# Altium project LimePSB-RPCM_1v4.PrjPcb (part 4 of 12)

## Sheet 08_FPGA.SchDoc: FPGA
size A3; Organization: Lime Microsystems; Address1: Surrey Tech Centre; Address2: Guildford GU2 7YG; Address3: Surrey; Address4: United Kingdom; Revision: 1.4; SheetNumber: 8; SheetTotal: 15
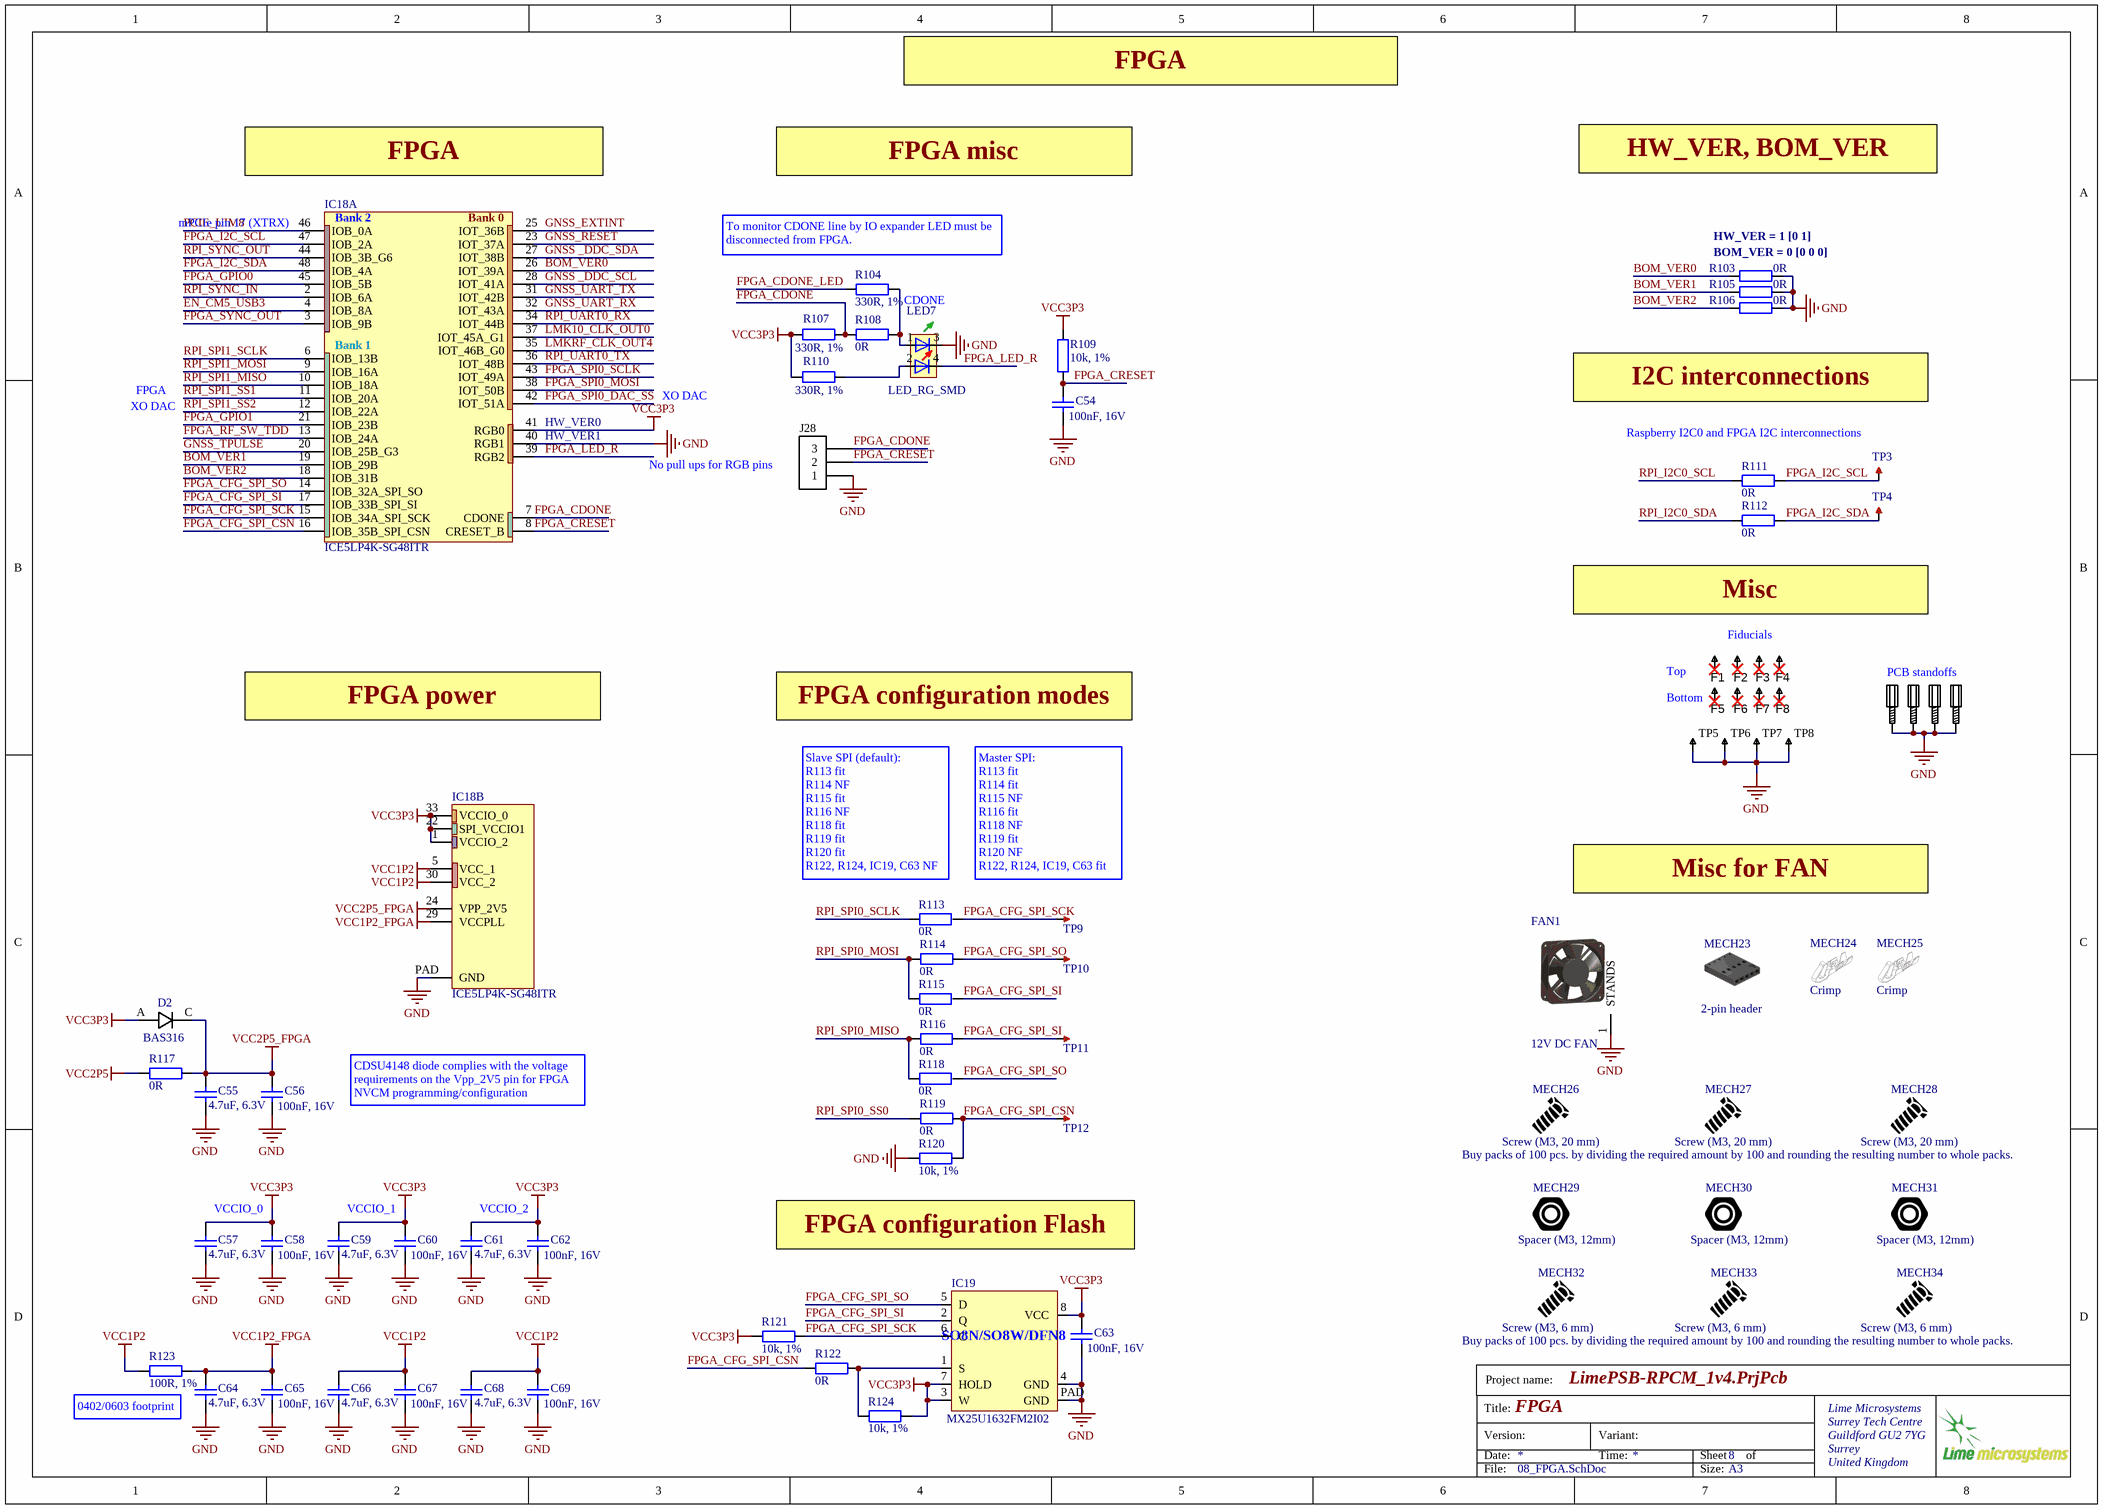
[diagram p7: 08_FPGA.SchDoc]

### Parts
C54  100nF, 16V  [CAP0402]
C55  4.7uF, 6.3V  [CAP0402]
C56  100nF, 16V  [CAP0402]
C57  4.7uF, 6.3V  [CAP0402]
C58  100nF, 16V  [CAP0402]
C59  4.7uF, 6.3V  [CAP0402]
C60  100nF, 16V  [CAP0402]
C61  4.7uF, 6.3V  [CAP0402]
C62  100nF, 16V  [CAP0402]
C63  100nF, 16V  [CAP0402]
C64  4.7uF, 6.3V  [CAP0402]
C65  100nF, 16V  [CAP0402]
C66  4.7uF, 6.3V  [CAP0402]
C67  100nF, 16V  [CAP0402]
C68  4.7uF, 6.3V  [CAP0402]
C69  100nF, 16V  [CAP0402]
D2  BAS316  [BAS316_DIODE_SOD323]
F1  Fiducial  [Fiducial]  (value not drawn)
F2  Fiducial  [Fiducial]  (value not drawn)
F3  Fiducial  [Fiducial]  (value not drawn)
F4  Fiducial  [Fiducial]  (value not drawn)
F5  Fiducial  [Fiducial]  (value not drawn)
F6  Fiducial  [Fiducial]  (value not drawn)
F7  Fiducial  [Fiducial]  (value not drawn)
F8  Fiducial  [Fiducial]  (value not drawn)
FAN1  12V DC FAN  [FAN_80mm_V1]
IC18  ICE5LP4K-SG48ITR  [ICE5LP4K-SG48ITR_Lattice_FPGA_QFN48]  (parts A,B of 2)
IC19  MX25U1632FM2I02  [S25FL164K_WSON8_DFN6]
J28  Header 3x1 pin  [HDR_1x3]  (value not drawn)
LED7  LED_RG_SMD  [LED-2x0603]
MECH19  # pcs.  [PCB_standoff]  (value not drawn)
MECH20  # pcs.  [PCB_standoff]  (value not drawn)
MECH21  # pcs.  [PCB_standoff]  (value not drawn)
MECH22  # pcs.  [PCB_standoff]  (value not drawn)
MECH23  2-pin header  (mechanical)
MECH24  Crimp  (mechanical)
MECH25  Crimp  (mechanical)
MECH26  Screw (M3, 20 mm)  (mechanical)
MECH27  Screw (M3, 20 mm)  Additional Info: Buy packs of 100 pcs. by dividing the required amount by 100 and rounding the resulting number to whole packs.  (mechanical)
MECH28  Screw (M3, 20 mm)  (mechanical)
MECH29  Spacer (M3, 12mm)  (mechanical)
MECH30  Spacer (M3, 12mm)  (mechanical)
MECH31  Spacer (M3, 12mm)  (mechanical)
MECH32  Screw (M3, 6 mm)  (mechanical)
MECH33  Screw (M3, 6 mm)  Additional Info: Buy packs of 100 pcs. by dividing the required amount by 100 and rounding the resulting number to whole packs.  (mechanical)
MECH34  Screw (M3, 6 mm)  (mechanical)
R103  0R  [RES0402]
R104  330R, 1%  [RES0402]
R105  0R  [RES0402]
R106  0R  [RES0402]
R107  330R, 1%  [RES0402]
R108  0R  [RES0402]
R109  10k, 1%  [RES0402]
R110  330R, 1%  [RES0402]
R111  0R  [RES0402]
R112  0R  [RES0402]
R113  0R  [RES0402]
R114  0R  [RES0402]
R115  0R  [RES0402]
R116  0R  [RES0402]
R117  0R  [RES0402]
R118  0R  [RES0402]
R119  0R  [RES0402]
R120  10k, 1%  [RES0402]
R121  10k, 1%  [RES0402]
R122  0R  [RES0402]
R123  100R, 1%  [RES0603]
R124  10k, 1%  [RES0402]
TP3  TESTPOINT_PAD  [TP_PAD_1p5MM]  (value not drawn)  (no BOM)
TP4  TESTPOINT_PAD  [TP_PAD_1p5MM]  (value not drawn)  (no BOM)
TP5  TESTPOINT_THT_MINI  [TP-SMD-LOW_PROFILE]  (value not drawn)
TP6  TESTPOINT_THT_MINI  [TP-SMD-LOW_PROFILE]  (value not drawn)
TP7  TESTPOINT_THT_MINI  [TP-SMD-LOW_PROFILE]  (value not drawn)
TP8  TESTPOINT_THT_MINI  [TP-SMD-LOW_PROFILE]  (value not drawn)
TP9  TESTPOINT_PAD  [TP_PAD_1p5MM]  (value not drawn)  (no BOM)
TP10  TESTPOINT_PAD  [TP_PAD_1p5MM]  (value not drawn)  (no BOM)
TP11  TESTPOINT_PAD  [TP_PAD_1p5MM]  (value not drawn)  (no BOM)
TP12  TESTPOINT_PAD  [TP_PAD_1p5MM]  (value not drawn)  (no BOM)

### Nets
GND: C54.2 C55.1 C56.2 C57.1 C58.2 C59.1 C60.2 C61.1 C62.2 C63.2 C64.1 C65.2 C66.1 C67.2 C68.1 C69.2 FAN1.1(STANDS) IC18.40(RGB1) IC18.PAD(GND) IC19.4(GND) IC19.PAD(GND) J28.1 LED7.3 MECH19.MH1 MECH20.MH1 MECH21.MH1 MECH22.MH1 R103.2 R105.2 R106.2 R120.1 TP5.1 TP6.1 TP7.1 TP8.1
VCC1P2: C66.2 C67.1 C68.2 C69.1 IC18.5(VCC_1) IC18.30(VCC_2) R123.2
VCC1P2_FPGA: C64.2 C65.1 IC18.29(VCCPLL) R123.1
VCC2P5: R117.2
VCC2P5_FPGA: C55.2 C56.1 D2.C IC18.24(VPP_2V5) R117.1
VCC3P3: C57.2 C58.1 C59.2 C60.1 C61.2 C62.1 C63.1 D2.A IC18.1(VCCIO_2) IC18.22(SPI_VCCIO1) IC18.33(VCCIO_0) IC18.41(RGB0) IC19.3(W) IC19.7(HOLD) IC19.8(VCC) R107.2 R109.1 R110.2 R121.2 R124.2
BOM_VER0: IC18.26(IOT_39A) R103.1
BOM_VER1: IC18.19(IOB_29B) R105.1
BOM_VER2: IC18.18(IOB_31B) R106.1
EN_CM5_USB3: IC18.4(IOB_8A)
FPGA_CDONE: IC18.7(CDONE) J28.3 R107.1 R108.1
FPGA_CDONE_LED: R104.1
FPGA_CFG_SPI_CSN: IC18.16(IOB_35B_SPI_CSN) R119.1 R120.2 R122.2 TP12.1
FPGA_CFG_SPI_SCK: IC18.15(IOB_34A_SPI_SCK) IC19.6(C) R113.2 R121.1 TP9.1
FPGA_CFG_SPI_SI: IC18.17(IOB_33B_SPI_SI) IC19.2(Q) R115.2 R116.1 TP11.1
FPGA_CFG_SPI_SO: IC18.14(IOB_32A_SPI_SO) IC19.5(D) R114.1 R118.2 TP10.1
FPGA_CRESET: C54.1 IC18.8(CRESET_B) J28.2 R109.2
FPGA_GPIO0: IC18.45(IOB_5B)
FPGA_GPIO1: IC18.21(IOB_23B)
FPGA_I2C_SCL: IC18.47(IOB_2A) R111.2 TP3.1
FPGA_I2C_SDA: IC18.48(IOB_4A) R112.2 TP4.1
FPGA_LED_R: IC18.39(RGB2) LED7.4
FPGA_RF_SW_TDD: IC18.13(IOB_24A)
FPGA_SPI0_DAC_SS: IC18.42(IOT_51A)
FPGA_SPI0_MOSI: IC18.38(IOT_50B)
FPGA_SPI0_SCLK: IC18.43(IOT_49A)
FPGA_SYNC_OUT: IC18.3(IOB_9B)
GNSS _DDC_SCL: IC18.28(IOT_41A)
GNSS _DDC_SDA: IC18.27(IOT_38B)
GNSS_EXTINT: IC18.25(IOT_36B)
GNSS_RESET: IC18.23(IOT_37A)
GNSS_TPULSE: IC18.20(IOB_25B_G3)
GNSS_UART_RX: IC18.32(IOT_43A)
GNSS_UART_TX: IC18.31(IOT_42B)
LMK10_CLK_OUT0: IC18.37(IOT_45A_G1)
LMKRF_CLK_OUT4: IC18.35(IOT_46B_G0)
PCIE_UIM8: IC18.46(IOB_0A)
RPI_I2C0_SCL: R111.1
RPI_I2C0_SDA: R112.1
RPI_SPI0_MISO: R116.2 R118.1
RPI_SPI0_MOSI: R114.2 R115.1
RPI_SPI0_SCLK: R113.1
RPI_SPI0_SS0: R119.2
RPI_SPI1_MISO: IC18.10(IOB_18A)
RPI_SPI1_MOSI: IC18.9(IOB_16A)
RPI_SPI1_SCLK: IC18.6(IOB_13B)
RPI_SPI1_SS1: IC18.11(IOB_20A)
RPI_SPI1_SS2: IC18.12(IOB_22A)
RPI_SYNC_IN: IC18.2(IOB_6A)
RPI_SYNC_OUT: IC18.44(IOB_3B_G6)
RPI_UART0_RX: IC18.34(IOT_44B)
RPI_UART0_TX: IC18.36(IOT_48B)
NetIC19_1: IC19.1(S) R122.1 R124.1
NetLED7_1: LED7.1 R104.2 R108.2
NetLED7_2: LED7.2 R110.1

Not connected (* = marked no-connect by the designer): F1 1*; F2 1*; F3 1*; F4 1*; F5 1*; F6 1*; F7 1*; F8 1*

### Notes on the sheet
- FPGA
- FPGA misc
- HW_VER, BOM_VER
- mPCIe pin 17 (XTRX)
- (near R104) To monitor CDONE line by IO expander LED must be disconnected from FPGA.
- HW_VER = 1 [0 1]
- (near R104) CDONE
- (near R103) BOM_VER = 0 [0 0 0]
- XO DAC
- (near IC18) HW_VER1
- (near IC18) HW_VER0
- I2C interconnections
- Raspberry I2C0 and FPGA I2C interconnections
- (near IC18) No pull ups for RGB pins
- Misc
- Fiducials
- FPGA power
- FPGA configuration modes
- Top
- (near F5) Bottom
- PCB standoffs
- (near R113) Slave SPI (default):
  R113 fit
  R114 NF
  R115 fit
  R116 NF
  R118 fit
  R119 fit
  R120 fit
  R122, R124, IC19, C63 NF
- Master SPI:
  R113 fit
  R114 fit
  R115 NF
  R116 fit
  R118 NF
  R119 fit
  R120 NF
  R122, R124, IC19, C63 fit
- Misc for FAN
- CDSU4148 diode complies with the voltage requirements on the Vpp_2V5 pin for FPGA NVCM programming/configuration
- VCCIO_0
- VCCIO_1
- VCCIO_2
- FPGA configuration Flash
- 0402/0603 footprint
- Project name:
- Title:
- Version:
- Date:
- Variant:
- Time:
- Sheet
- of
- File:
- Size:
- A3
- (in symbol ICE5LP4K-SG48ITR_Lattice_FPGA, part A) Bank 2; Bank 0; Bank 1
- (in symbol M25P40_with_pad) SO8N/SO8W/DFN8

### Library data of the parts
C54 C56 C58 C60 C62 C63 C65 C67 C69 = Cap_0603: Manufacturer Part Number 1: GRM155R71C104KA88D; Part Description: 0.10µF ±10% 16V Ceramic Capacitor X7R 0402 (1005 Metric); Brand: Murata Electronics; Tolerance: 10 %; Type: General Purpose MLCC; Capacitance: 0.1 uF; Temperature Coefficient / Code: +/- 15 %; Case Height: 0.5 mm; Case Length: 1 mm; Dielectric: X7R; Supplier 1: Mouser; Supplier Part Number 1: 81-GRM155R71C104KA88; Case Code - in: 0402; Manufacturer: Murata Electronics; Category: Multilayer Ceramic Capacitors MLCC - SMD/SMT; Voltage Rating DC: 16 V; Value: 100nF, 16V; Manufacturer Part Number: GRM155R71C104KA88D; Case Code - mm: 1005; Case Width: 0.5 mm; Maximum Operating Temperature: + 125 C; Minimum Operating Temperature: - 55 C; Minimum Order Quantity: 1; Operating Temperature Range: - 55 C to + 125 C; Package / Case: 0402 (1005 metric); Packaging: Reel; Product: General Type MLCCs; Product Category: Low & Medium Capacitance SMD Ceramic Chip Capacitors; Reeling: True; RoHS - Mouser: Y; RoHS: RoHS Compliant; Series: GRM; Standard Pack Qty: 10000; Termination Style: SMD/SMT
C55 C57 C59 C61 C64 C66 C68 = Cap_0402: Manufacturer: Murata Electronics North America; Manufacturer Part Number: GRM155R60J475ME87D; Part Description: 4.7µF ±20% 6.3V X5R Ceramic Capacitor -55°C ~ 85°C Surface Mount, MLCC 0402 (1005 Metric) 0.039" L x 0.020" W (1.00mm x 0.50mm); Tolerance: ±20%; Capacitance: 4.7µF; Temperature Coefficient: X5R; Lead Style: -; Ratings: -; Height - Seated (Max): -; Thickness (Max): 0.022" (0.55mm); Voltage - Rated: 6.3V; Packaging: Cut Tape (CT); Lead Spacing: -; Category: Capacitors; Supplier Part Number 1: 490-5408-1-ND; Applications: General Purpose; Operating Temperature: -55°C ~ 85°C; Mounting Type: Surface Mount, MLCC; Features: Derating Recommended; RoHS: RoHS Compliant; Supplier 1: Digi-Key; Package / Case: 0402 (1005 Metric); Size / Dimension: 0.039" L x 0.020" W (1.00mm x 0.50mm); Value: 4.7uF, 6.3V; Manufacturer Part Number 1: GRM155R60J475ME87D
D2 = MURA120T3G_diode: Part Description: DIODE GEN PURP 100V 250MA SOD323; Manufacturer: Nexperia; Manufacturer Part Number 1: BAS316,115; ComponentLink1URL: http://www.mouser.com/ds/2/427/mmsz5225-102133.pdf; ComponentLink1Description: http://www.mouser.com/ds/2/427/mmsz5225-102133.pdf; ComponentLink2URL: http://www.onsemi.com/pub/Collateral/MMSD4148T1-D.PDF; ComponentLink2Description: http://www.onsemi.com/pub/Collateral/MMSD4148T1-D.PDF; ComponentLink3URL: http://www.farnell.com/datasheets/1707241.pdf; ComponentLink3Description: http://www.farnell.com/datasheets/1707241.pdf; ComponentLink4URL: https://www.verical.com/server-webapp/html/getDatasheet?partID=78734; ComponentLink4Description: https://www.verical.com/server-webapp/html/getDatasheet?partID=78734; ComponentLink5URL: http://www.onsemi.com/pub/Collateral/MURA115T3-D.PDF; ComponentLink5Description: http://www.onsemi.com/pub/Collateral/MURA115T3-D.PDF; ComponentLink6URL: http://www.jameco.com/Jameco/Products/ProdDS/1100812.pdf; ComponentLink6Description: http://www.jameco.com/Jameco/Products/ProdDS/1100812.pdf; ComponentLink7URL: http://uk.rs-online.com/webdocs/1221/0900766b812212fb.pdf; ComponentLink7Description: http://uk.rs-online.com/webdocs/1221/0900766b812212fb.pdf; ComponentLink8URL: http://www.farnell.com/datasheets/1750742.pdf; ComponentLink8Description: http://www.farnell.com/datasheets/1750742.pdf; Supplier 1: Digi-Key; Supplier Part Number 1: 1727-4309-1-ND; Stock 1: 163548; Pricing 1: 1=0,16000, 10=0,14200, 100=0,07710, 500=0,04744, 1000=0,03234 (USD); RoHS: Yes; RoHS Compliant: Yes; ComponentLink9URL: http://www.farnell.com/datasheets/1856332.pdf?src-supplier=Farnell; ComponentLink9Description: http://www.farnell.com/datasheets/1856332.pdf?src-supplier=Farnell; ComponentLink10URL: https://assets.nexperia.com/documents/data-sheet/BAS16_SER.pdf?src-supplier=Digi-Key; ComponentLink10Description: https://assets.nexperia.com/documents/data-sheet/BAS16_SER.pdf?src-supplier=Digi-Key; ComponentLink11URL: http://www.farnell.com/datasheets/1856332.pdf?src-supplier=Newark; ComponentLink11Description: http://www.farnell.com/datasheets/1856332.pdf?src-supplier=Newark
FAN1 = 12V_DC_FAN: Part Description: Fan Tubeaxial 12VDC Square - 80mm L x 80mm H Vapo-Bearing™ 37.0 CFM (1.04m³/min) 2 Wire Leads; Manufacturer: Sunon; Manufacturer Part Number 1: ME80151V1-000U-A99; Airflow: 37CFM; Noise: 34.7dBA; Max Power Dissipation: 1.96W; RPM: 3000RPM; Bearing Type: Vapo-Bearing; Current Rating: 163mA; Approvals: UL,CE,TUV; Supplier 1: Digi-Key; Supplier Part Number 1: 259-1649-ND; Stock 1: 1611; Pricing 1: 1=6,90000, 10=6,66700, 25=6,47400, 50=6,08860, 100=5,47200, 250=5,39488, 500=5,04808 (USD); RoHS: Yes; Case/Package: Axial; Housing Material: Thermoplastic; Weight: 0.15lb; Min Operating Temperature: 14°C; Max Operating Temperature: 158°C; Termination: 2 Wire Leads; Package Quantity: 30; Width: 15mm; Flammability Rating: UL94 V-0; ComponentLink1URL: https://datasheet.ciiva.com/18514/me8015-u-18514537.pdf?src-supplier=Digi-Key; ComponentLink1Description: https://datasheet.ciiva.com/18514/me8015-u-18514537.pdf?src-supplier=Digi-Key
IC18 = ICE5LP4K-SG48ITR_Lattice_FPGA: Part Description: iCE40 Ultra™ Field Programmable Gate Array (FPGA) IC 39 81920 3520 48-VFQFN Exposed Pad; Manufacturer: Lattice Semiconductor; Supplier 1: Digikey; Supplier Part Number 1: 220-2234-1-ND; Manufacturer Part Number 1: ICE5LP4K-SG48ITR; Stock 1: 1298; Pricing 1: 1=8,8, 25=7,65, 100=7,41 (USD); RoHS: Yes; ComponentLink1URL: https://datasheet.octopart.com/ICE5LP4K-SG48ITR-Lattice-Semiconductor-datasheet-46750633.pdf?src-supplier=Future+Electronics; ComponentLink1Description: https://datasheet.octopart.com/ICE5LP4K-SG48ITR-Lattice-Semiconductor-datasheet-46750633.pdf?src-supplier=Future+Electronics; ComponentLink2URL: http://www.latticesemi.com/~/media/LatticeSemi/Documents/DataSheets/iCE/iCE40UltraFamilyDataSheet.pdf?src-supplier=Digikey; ComponentLink2Description: http://www.latticesemi.com/~/media/LatticeSemi/Documents/DataSheets/iCE/iCE40UltraFamilyDataSheet.pdf?src-supplier=Digikey; ComponentLink3URL: https://datasheet.octopart.com/ICE5LP4K-SG48ITR-Lattice-Semiconductor-datasheet-94675077.pdf?src-supplier=SHENGYU+ELECTRONICS; ComponentLink3Description: https://datasheet.octopart.com/ICE5LP4K-SG48ITR-Lattice-Semiconductor-datasheet-94675077.pdf?src-supplier=SHENGYU+ELECTRONICS
IC19 = M25P40_with_pad: Part Description: IC FLASH 16MBIT SPI/QUAD 8SOP; Manufacturer: Macronix; ComponentLink1URL: http://www.winbond.com/resource-files/w25q128jv%20revf%2003272018%20plus.pdf?src-supplier=Digi-Key; ComponentLink1Description: http://www.winbond.com/resource-files/w25q128jv%20revf%2003272018%20plus.pdf?src-supplier=Digi-Key; ComponentLink2URL: http://www.macronix.com/Lists/Datasheet/Attachments/7549/MX25L25645G,%203V,%20256Mb,%20v1.7.pdf?src-supplier=Digi-Key; ComponentLink2Description: http://www.macronix.com/Lists/Datasheet/Attachments/7549/MX25L25645G,%203V,%20256Mb,%20v1.7.pdf?src-supplier=Digi-Key; ComponentLink3URL: http://ckassoc.com/oldsite/pdf/Macronix_Product_Line_Card_July_2017_General%20_070617.pdf?src-supplier=Digi-Key; ComponentLink3Description: http://ckassoc.com/oldsite/pdf/Macronix_Product_Line_Card_July_2017_General%20_070617.pdf?src-supplier=Digi-Key; ComponentLink4URL: http://www.macronix.com/Lists/Datasheet/Attachments/7444/MX25L25673G,%203V,%20256Mb,%20v1.4.pdf?src-supplier=Digi-Key; ComponentLink4Description: http://www.macronix.com/Lists/Datasheet/Attachments/7444/MX25L25673G,%203V,%20256Mb,%20v1.4.pdf?src-supplier=Digi-Key; Value: MX25U1632FM2I02; Supplier 1: Digikey; Supplier Part Number 1: 1092-MX25U1632FM2I02-ND; Manufacturer Part Number 1: MX25U1632FM2I02; Stock 1: 6909; Pricing 1: 1=0,6, 10=0,536, 25=0,5116, 92=0,47837, 184=0,46158, 276=0,45203, 552=0,43612, 1012=0,42265, 5060=0,4 (USD); RoHS: No
J28 = Header3P: Header, 3-pin; Manufacturer 1: Wurth Electronics; Manufacturer Part Number: 61300311121; Part Description: Connector Header Through Hole 3 position 0.100" (2.54mm); Number of Positions: 3; Gender: Male; Connector Type: Male Pin; Pitch: 0.1inch; Supplier 1: Digi-Key; Supplier Part Number 1: 732-5316-ND; Stock 1: 95926; Pricing 1: 1=0,13000, 10=0,11300, 25=0,09400, 50=0,07900, 100=0,07100, 1000=0,06600 (USD); RoHS: Yes; Mount: Through Hole; Contact Plating: Gold; Contact Material: Copper; Color: Black; Number of Rows: 1; Packaging: Bulk; Termination: Solder; Number of Contacts: 3; Contact Mating Length: 0.236inch; REACH SVHC: Unknown; Lead Free: Lead Free; RoHS Compliant: Yes; ComponentLink1URL: http://www.farnell.com/cad/1737268.pdf?src-supplier=Element14; ComponentLink1Description: http://www.farnell.com/cad/1737268.pdf?src-supplier=Element14; ComponentLink2URL: https://katalog.we-online.de/em/datasheet/6130xx11121.pdf?src-supplier=Digi-Key; ComponentLink2Description: https://katalog.we-online.de/em/datasheet/6130xx11121.pdf?src-supplier=Digi-Key; Manufacturer: Wurth Electronics; Manufacturer Part Number 1: 61300311121
LED7 = LED_green_red_SMD: Manufacturer Part Number 1: HSMF-C165; Manufacturer: Avago Technologies US Inc.; Part Description: LED GREEN/RED DIFFUSED 0603 SMD; Millicandela Rating: 15mcd Green, 10mcd Red; Lens Transparency: Diffused; Lens Color: White; Lens Style/Size: Rectangle with Flat Top, 1.60mm x 0.80mm; Wavelength - Peak: 570nm Green, 636nm Red; Wavelength - Dominant: 572nm Green, 621nm Red; Viewing Angle: 120°; Voltage - Forward (Vf) (Typ): 2.2V Green, 1.95V Red; Current - Test: 20mA; Color: Green, Red; Supplier 1: Digi-Key; Height (Max): 0.50mm; Packaging: Cut Tape (CT); Category: Optoelectronics; Mounting Type: Surface Mount; Package / Case: 0603 (1608 Metric); Size / Dimension: 1.60mm L x 0.80mm W; Supplier Device Package: *; RoHS: RoHS Compliant; Supplier Part Number 1: 516-1419-1-ND
MECH19-MECH22 = STANDOFF_M-F_THREADED_M3x8x10mm_HEX_5mm dia: STANDOFF M/F MET 5MM HEX 10MM L; Manufacturer: FIX&FASTEN; Manufacturer Part Number 1: FIX-MAE-5TV; Part Description: PCB distance; polyamide; L:5mm; Colour: natural; Øcutout:3mm; Unit: pcs; SuppliedAmount: 1000; MinAmount: 10; Type of spacer: PCB distance; Panel cutout diameter: 3mm; Spanner size: 5.5mm; Internal thread: M3; Thread pitch: 0,5; Supplier 1: TME; Supplier Part Number 1: FIX-MAE-5TV; Category: Plastic Pegs; Weight: 0.145; Multiples: 10; Material: polyamide; Spacer length: 5mm; Price Type: NET
MECH23 = Universal_crimped_header: Part Description: 2 Rectangular Connectors - Housings Receptacle White 0.100" (2.54mm); Manufacturer: Molex; Gender: Female; Voltage Rating: 250V; Number of Contacts: 2; Connector Type: Receptacle; Max Current Rating: 4A; Pitch: 2.54mm; Glow Wire Compliant: Non-compliant; Approvals: UL,CSA; Supplier 1: Newark; Supplier Part Number 1: 47T5763; Manufacturer Part Number 1: 22-01-2027; Stock 1: 50789; Pricing 1: 1=0,12200, 10=0,09500, 25=0,08600, 50=0,07700, 100=0,06700, 250=0,06400 (USD); RoHS: Yes; Mount: Free Hanging,Cable; Contact Material: Bronze,Brass; Color: White; Housing Color: White; Housing Material: Nylon; Min Operating Temperature: 0°C; Max Operating Temperature: 75°C; Number of Rows: 1; Package Quantity: 5000; Packaging: Bag; Termination: Crimp; Number of Circuits: 2; Number of Positions: 2; Orientation: Straight; Series: KK® 2695; Contact Type: Non-Gendered; Contact Gender: Female; Fastening Type: Ramp; Length: 5.64mm; Width: 4.82mm; Height: 4.82mm; Depth: 12.7mm; Lead Pitch: 2.54mm; Radiation Hardening: No; Halogen Free: Low Halogen; Flammability Rating: UL94 V-0; RoHS Compliant: Yes; Lead Free: Lead Free
MECH24 MECH25 = Universal_crimp: Part Description: Non-Gendered Contact Tin 22-30 AWG Crimp; Manufacturer: Molex; Body Plating: Tin; Current Rating: 4A; Voltage Rating: 250V; Gender: Female; Connector Type: PCB; Number of Contacts: 1; Contact Resistance: 20mR; Max Current Rating: 2.5A; Resistance: 0.02R; Insulation Resistance: 500GR; Shielding: Unshielded; Wire Gauge (Max): 22AWG; Wire Gauge (Min): 30AWG; Wire/Cable Diameter: 1.57mm; Approvals: UL,CSA; Supplier 1: Mouser; Supplier Part Number 1: 538-08-50-0032; Manufacturer Part Number 1: 08-50-0032; Stock 1: 153072; Pricing 1: 1=0,12000, 10=0,08100, 50=0,08000, 100=0,08000, 1000=0,06400, 10000=0,06400 (USD); RoHS: Yes; Mount: Cable; Contact Material: Brass; Housing Material: Nylon; Terminal Material: Brass; Contact Plating: Tin,Brass; Min Operating Temperature: 0°C; Max Operating Temperature: 75°C; Contact Gender: Female; Packaging: Bulk; Termination: Crimp; Orientation: Straight; Series: KK® 4809; Contact Type: Signal; Voltage Rating (AC): 250V; Package Quantity: 80000; Max Voltage Rating (AC): 250V; Length: 10.4mm; Depth: 2.1mm; Wire/Cable Gauge: 30AWG; Radiation Hardening: No; RoHS Compliant: Yes; Reach SVHC Compliant: Yes; ComponentLink1URL: https://datasheet.ciiva.com/15217/getdatasheetpartid-168593-15217171.pdf?src-supplier=Verical; ComponentLink1Description: https://datasheet.ciiva.com/15217/getdatasheetpartid-168593-15217171.pdf?src-supplier=Verical; ComponentLink2URL: https://datasheet.ciiva.com/19462/736464-19462410.pdf?src-supplier=Jameco; ComponentLink2Description: https://datasheet.ciiva.com/19462/736464-19462410.pdf?src-supplier=Jameco; ComponentLink3URL: https://datasheet.ciiva.com/11723/0900766b80027326-11723308.pdf?src-supplier=Rs; ComponentLink3Description: https://datasheet.ciiva.com/11723/0900766b80027326-11723308.pdf?src-supplier=Rs
MECH26 MECH28 = Universal_mech_screw: Part Description: Machine Screw, M3, 20 mm, Steel, Bright Zinc, Flat / Countersunk Head Pozidriv, Pack of 100; Manufacturer: TR Fastenings; Manufacturer Part Number 1: M3 20 KRSTMC Z100; Additional Info: Buy packs of 100 pcs. by dividing the required amount by 100 and rounding the resulting number to whole packs.; Supplier 1: Farnell; Supplier Part Number 1: 1420401; Stock 1: 226; Pricing 1: 1=2,66000, 30=1,88000, 60=1,77000 (EUR); RoHS: No; ComponentLink1URL: http://www.farnell.com/datasheets/2644719.pdf?src-supplier=Farnell; ComponentLink1Description: http://www.farnell.com/datasheets/2644719.pdf?src-supplier=Farnell
MECH27 = Universal_mech_screw: Part Description: Machine Screw, M3, 20 mm, Steel, Bright Zinc, Flat / Countersunk Head Pozidriv, Pack of 100; Manufacturer: TR Fastenings; Manufacturer Part Number 1: M3 20 KRSTMC Z100; Supplier 1: Farnell; Supplier Part Number 1: 1420401; Stock 1: 226; Pricing 1: 1=2,66000, 30=1,88000, 60=1,77000 (EUR); RoHS: No; ComponentLink1URL: http://www.farnell.com/datasheets/2644719.pdf?src-supplier=Farnell; ComponentLink1Description: http://www.farnell.com/datasheets/2644719.pdf?src-supplier=Farnell
MECH29-MECH31 = Universal_mech_nut: Part Description: Standoff, Brass, M3, Hex Female, 12 mm, 12 mm; Manufacturer: ETTINGER; Manufacturer Part Number 1: 005.03.123; Supplier 1: Farnell; Supplier Part Number 1: 1466772
MECH32 MECH34 = Universal_mech_screw: Part Description: Machine Screw, M3, 6 mm, Steel 4.8, Bright Zinc, Pan Head Pozidriv; Manufacturer: TR Fastenings; Manufacturer Part Number 1: M3 6 PRSTMC Z100; Additional Info: Buy packs of 100 pcs. by dividing the required amount by 100 and rounding the resulting number to whole packs.; Supplier 1: Farnell; Supplier Part Number 1: 1419986; Stock 1: 2173; Pricing 1: 1=1,90000, 25=1,35000, 50=1,23000 (EUR); RoHS: No; ComponentLink1URL: http://www.farnell.com/datasheets/2644718.pdf?src-supplier=Farnell; ComponentLink1Description: http://www.farnell.com/datasheets/2644718.pdf?src-supplier=Farnell
MECH33 = Universal_mech_screw: Part Description: Machine Screw, M3, 6 mm, Steel 4.8, Bright Zinc, Pan Head Pozidriv; Manufacturer: TR Fastenings; Manufacturer Part Number 1: M3 6 PRSTMC Z100; Supplier 1: Farnell; Supplier Part Number 1: 1419986; Stock 1: 2173; Pricing 1: 1=1,90000, 25=1,35000, 50=1,23000 (EUR); RoHS: No; ComponentLink1URL: http://www.farnell.com/datasheets/2644718.pdf?src-supplier=Farnell; ComponentLink1Description: http://www.farnell.com/datasheets/2644718.pdf?src-supplier=Farnell
R103 R105 R106 = Res_0402: Manufacturer: Yageo; Part Description: RES SMD 0.0OHM JUMPER 1/16W 0402; Manufacturer Part Number 1: RC0402JR-070RL; Supplier 1: Digi-Key; Supplier Part Number 1: 311-0.0JRTR-ND; Composition: Thick Film; Package / Case: 0402 (1005 Metric); Category: Resistors; Value: 0R
R104 R107 R110 = Res_0402: Manufacturer: Yageo; Manufacturer Part Number 1: RC0402FR-07330RL; Part Description: 330 Ohms ±1% 0.063W, 1/16W Chip Resistor 0402 (1005 Metric) Moisture Resistant Thick Film; Max Power Dissipation: 63mW; Power Rating: 62.5mW; Temperature Coefficient: 100ppm/°C; Voltage Rating: 50V; Case/Package: 0402; Case Code (Imperial): 0402; Case Code (Metric): 1005; ComponentLink1Description: http://www.farnell.com/datasheets/2167052.pdf?src-supplier=Farnell; ComponentLink1URL: http://www.farnell.com/datasheets/2167052.pdf?src-supplier=Farnell; ComponentLink2Description: http://www.farnell.com/datasheets/2167052.pdf?src-supplier=Newark; ComponentLink2URL: http://www.farnell.com/datasheets/2167052.pdf?src-supplier=Newark; ComponentLink3Description: http://www.farnell.com/datasheets/1018594.pdf?src-supplier=Element14; ComponentLink3URL: http://www.farnell.com/datasheets/1018594.pdf?src-supplier=Element14; Construction: Rectangular; Depth: 0.5mm; Features: Moisture Resistant; Height: 0.016inch; Lead Free: Lead Free; Length: 0.039inch; Max Operating Temperature: 155°C; Military Standard: Not; Min Operating Temperature: -55°C; Number of Terminations: 2; Package Quantity: 1; Packaging: Tape and Reel; Pricing 1: 1=0,10000, 10=0,01500, 100=0,00610, 1000=0,00275, 2500=0,00239, 5000=0,00197 (USD); REACH SVHC: Unknown; Resistance: 330R; Resistance Tolerance: 1%; Resistor Type: Thick Film; RoHS: Yes; RoHS Compliant: Yes; Series: RC; Size Code: 0402; Stock 1: 7298585; Supplier 1: Digi-Key; Supplier Part Number 1: 311-330LRCT-ND; Technology: THICK FILM; Termination: SMD/SMT; Tolerance: 1%; Value: 330R, 1%; Width: 0.02inch
R108 R111-R119 R122 = Res_0402: Manufacturer Part Number 1: RC0402JR-070RL; Manufacturer: Yageo; Part Description: RES SMD 0.0OHM JUMPER 1/16W 0402; Resistance (Ohms): 0.0; Tolerance: Jumper; Power (Watts): 0.063W, 1/16W; Value: 0R; Supplier 1: Digi-Key; Supplier Part Number 1: 311-0.0JRTR-ND; Category: Resistors; Temperature Coefficient: -; Features: Moisture Resistant; Supplier Device Package: 0402; Height: 0.016" (0.40mm); Package / Case: 0402 (1005 Metric); Operating Temperature: -55°C ~ 155°C; Size / Dimension: 0.039" L x 0.020" W (1.00mm x 0.50mm); Composition: Thick Film; Packaging: Tape & Reel (TR); Number of Terminations: 2; RoHS: RoHS Compliant
R109 R120 R121 R124 = Res_0402: Manufacturer: Yageo; Manufacturer Part Number 1: RC0402FR-0710KL; Part Description: RES SMD 10K OHM 1% 1/16W 0402; Temperature Coefficient: ±100ppm/°C; Power (Watts): 0.063W, 1/16W; Value: 10k, 1%; Supplier 1: Digi-Key; Supplier Part Number 1: 311-10.0KLRTR-ND; Resistance (Ohms): 10k; Packaging: Tape & Reel (TR); RoHS: RoHS Compliant; Package / Case: 0402 (1005 Metric); Tolerance: ±1%; Operating Temperature: -55°C ~ 155°C; Size / Dimension: 0.039" L x 0.020" W (1.00mm x 0.50mm); Number of Terminations: 2; Category: Resistors; Height: 0.016" (0.40mm); Supplier Device Package: 0402; Features: Moisture Resistant; Composition: Thick Film
R123 = Res_0402: Manufacturer Part Number 1: RMCF0402FT100R; Manufacturer: Stackpole Electronics Inc.; Part Description: RES SMD 100 OHM 1% 1/16W 0402; Power (Watts): 0.063W, 1/16W; Temperature Coefficient: ±100ppm/°C; Resistance (Ohms): 100; Value: 100R, 1%; Supplier 1: Digi-Key; Supplier Part Number 1: RMCF0402FT100RDKR-ND; Packaging: Digi-Reel®; Composition: Thick Film; Number of Terminations: 2; Package / Case: 0402 (1005 Metric); RoHS: RoHS Compliant; Category: Resistors; Size / Dimension: 0.039" L x 0.020" W (1.00mm x 0.50mm); Tolerance: ±1%; Supplier Device Package: 0402; Features: -; Height: 0.016" (0.40mm); Operating Temperature: -55°C ~ 155°C
TP3 TP4 TP9-TP12 = TESTPOINT_PAD: Test Point PCB mount Miniature White
TP5-TP8 = TESTPOINT_THT_MINI: Test Point PCB mount Miniature White; Manufacturer Part Number 1: S1751-46R; Manufacturer: Harwin Inc; Part Description: Natural PC Test Point 0.128" x 0.065" x 0.079" (3.25mm x 1.65mm x 2.00mm) Brass, Tin Plating Surface Mount Mounting Type; Supplier 1: Digi-Key; Supplier Part Number 1: 952-1478-2-ND; RoHS: RoHS Compliant; Color: Natural; Material: Copper Alloy; Mounting Type: Surface Mount; Terminal: 0.128" x 0.065" x 0.079" (3.25mm x 1.65mm x 2.00mm) Brass, Tin Plated; Type: PC Test Point; Packaging: Tape & Reel (TR); Category: Test and Measurement